# Altium schematic sheet Microphone-Arm_V1.0.SchDoc: Microphone-Arm
size A4; PageSetup: Record=PageOptions|CenterHorizontal=True|CenterVertical=True|PrintScale=0.97|XCorrection=1.00|YCorrection=1.00|PrintKind=0|BorderSize=5000000|LeftOffset=0|BottomOffset=0|Orientation=2|PaperLength=1000|PaperWidth=1000|Scale=100|PaperSource=7|PrintQuality=-3|MediaType=1|DitherType=10|PrintScaleMode=1|PaperKind=A4|PaperIndex=9; Organization: Ostschweizer Fachhochschule; Address2: Florian Baumgartner & Alain Keller; Address3: florian.baumgartner@ost.ch; DocumentNumber: 1; Revision: V1.0; SheetNumber: 1; SheetTotal: 1; Author: Florian Baumgartner & Alain Keller; Subtitle: Pivotable Microphone-Array Arm
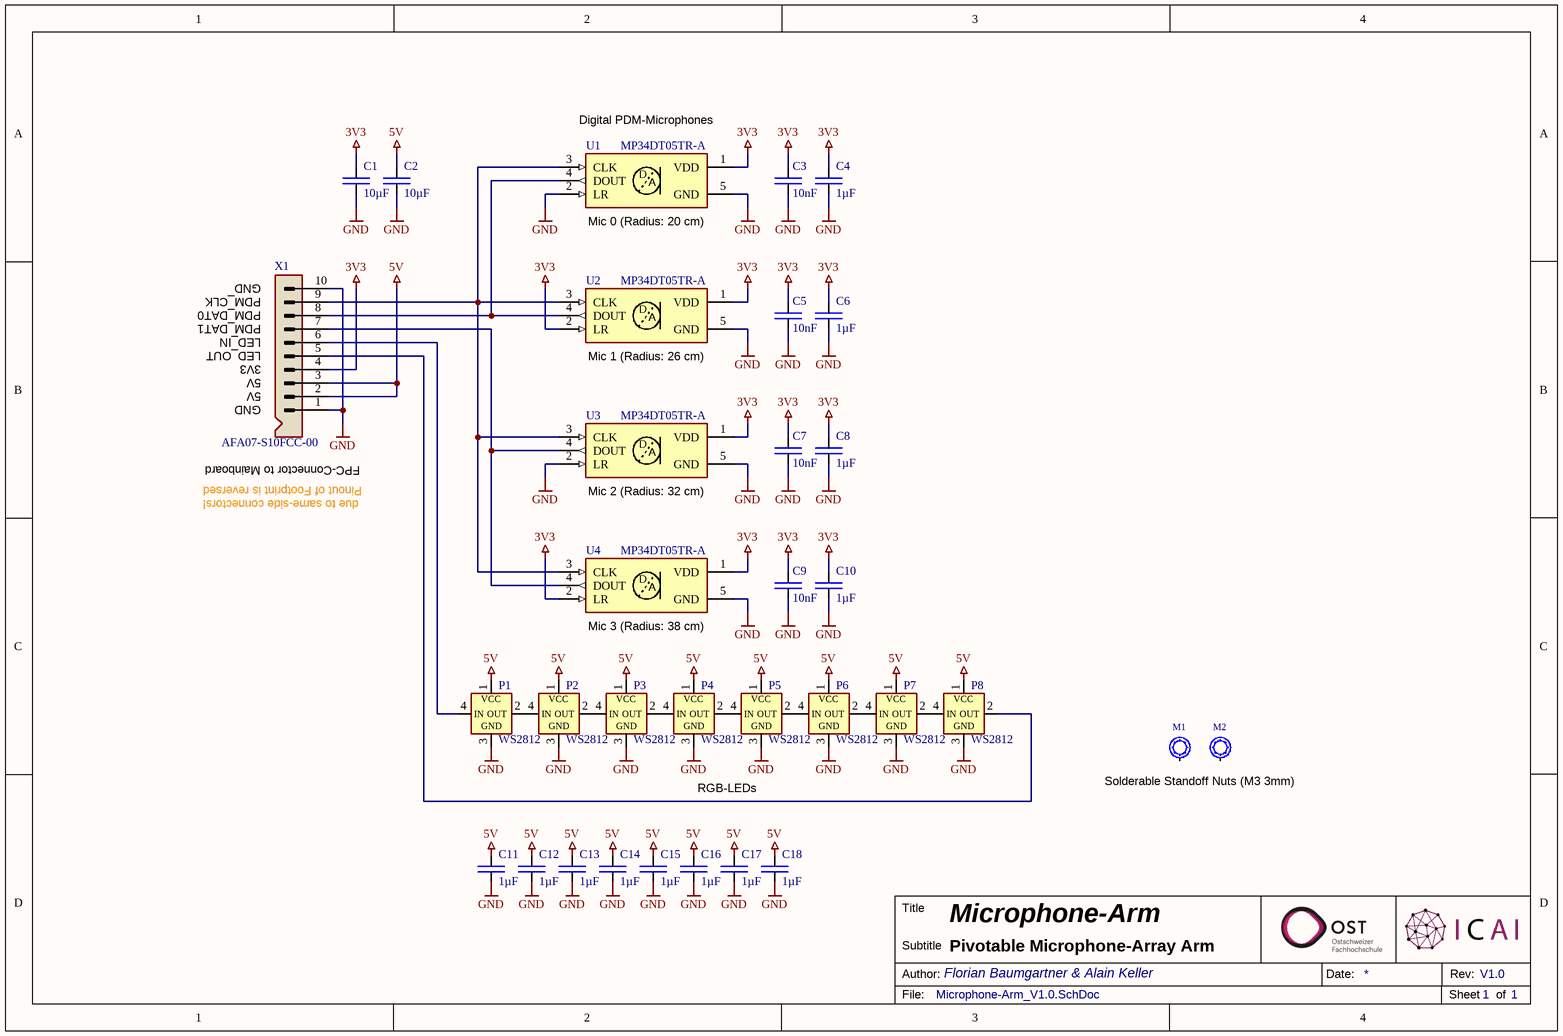
[diagram p0: Microphone-Arm_V1.0.SchDoc]

## Parts
C1  10µF  [SMD Keramikkondensator 1206]
C2  10µF  [SMD Keramikkondensator 1206]
C3  10nF  [SMD Keramikkondensator 0603]
C4  1µF  [SMD Keramikkondensator 0603]
C5  10nF  [SMD Keramikkondensator 0603]
C6  1µF  [SMD Keramikkondensator 0603]
C7  10nF  [SMD Keramikkondensator 0603]
C8  1µF  [SMD Keramikkondensator 0603]
C9  10nF  [SMD Keramikkondensator 0603]
C10  1µF  [SMD Keramikkondensator 0603]
C11  1µF  [SMD Keramikkondensator 0603]
C12  1µF  [SMD Keramikkondensator 0603]
C13  1µF  [SMD Keramikkondensator 0603]
C14  1µF  [SMD Keramikkondensator 0603]
C15  1µF  [SMD Keramikkondensator 0603]
C16  1µF  [SMD Keramikkondensator 0603]
C17  1µF  [SMD Keramikkondensator 0603]
C18  1µF  [SMD Keramikkondensator 0603]
M1  SMTSO-M3-3ET  [SMD Solder-Nut (M3 3mm)]  (value not drawn)
M2  SMTSO-M3-3ET  [SMD Solder-Nut (M3 3mm)]  (value not drawn)
P1  WS2812  [SMD LED WS2812B-0807]
P2  WS2812  [SMD LED WS2812B-0807]
P3  WS2812  [SMD LED WS2812B-0807]
P4  WS2812  [SMD LED WS2812B-0807]
P5  WS2812  [SMD LED WS2812B-0807]
P6  WS2812  [SMD LED WS2812B-0807]
P7  WS2812  [SMD LED WS2812B-0807]
P8  WS2812  [SMD LED WS2812B-0807]
U1  MP34DT05TR-A  [SMD Microphone (MP34DT05TR-A)]
U2  MP34DT05TR-A  [SMD Microphone (MP34DT05TR-A)]
U3  MP34DT05TR-A  [SMD Microphone (MP34DT05TR-A)]
U4  MP34DT05TR-A  [SMD Microphone (MP34DT05TR-A)]
X1  AFA07-S10FCC-00  [SMD Connector (AFA07-S10FCC-00) [Reversed]]

## Nets
3V3: C1.2 C3.2 C4.2 C5.2 C6.2 C7.2 C8.2 C9.2 C10.2 U1.1(VDD) U2.1(VDD) U2.2(LR) U3.1(VDD) U4.1(VDD) U4.2(LR) X1.4
5V: C2.2 C11.2 C12.2 C13.2 C14.2 C15.2 C16.2 C17.2 C18.2 P1.1(VCC) P2.1(VCC) P3.1(VCC) P4.1(VCC) P5.1(VCC) P6.1(VCC) P7.1(VCC) P8.1(VCC) X1.2 X1.3
GND: C1.1 C2.1 C3.1 C4.1 C5.1 C6.1 C7.1 C8.1 C9.1 C10.1 C11.1 C12.1 C13.1 C14.1 C15.1 C16.1 C17.1 C18.1 P1.3(GND) P2.3(GND) P3.3(GND) P4.3(GND) P5.3(GND) P6.3(GND) P7.3(GND) P8.3(GND) U1.2(LR) U1.5(GND) U2.5(GND) U3.2(LR) U3.5(GND) U4.5(GND) X1.1 X1.10
NetP1_2: P1.2(OUT) P2.4(IN)
NetP1_4: P1.4(IN) X1.6
NetP2_2: P2.2(OUT) P3.4(IN)
NetP3_2: P3.2(OUT) P4.4(IN)
NetP4_2: P4.2(OUT) P5.4(IN)
NetP5_2: P5.2(OUT) P6.4(IN)
NetP6_2: P6.2(OUT) P7.4(IN)
NetP7_2: P7.2(OUT) P8.4(IN)
NetP8_2: P8.2(OUT) X1.5
NetU1_3: U1.3(CLK) U2.3(CLK) U3.3(CLK) U4.3(CLK) X1.9
NetU1_4: U1.4(DOUT) U2.4(DOUT) X1.8
NetU3_4: U3.4(DOUT) U4.4(DOUT) X1.7

Not connected (* = marked no-connect by the designer): M1 1; M2 1

## Notes on the sheet
- (near U1) Digital PDM-Microphones
- (near U1) Mic 0 (Radius: 20 cm)
- (near X1) PDM_CLK
- (near X1) PDM_DAT0
- (near X1) GND
- (near X1) PDM_DAT1
- (near X1) LED_IN
- (near X1) LED_OUT
- (near X1) 5V
- (near X1) 3V3
- (near U2) Mic 1 (Radius: 26 cm)
- FPC-Connector to Mainboard
- Pinout of Footprint is reversed
- due to same-side connectors!
- (near U3) Mic 2 (Radius: 32 cm)
- (near U4) Mic 3 (Radius: 38 cm)
- RGB-LEDs
- Solderable Standoff Nuts (M3 3mm)
- Title
- Author:
- Subtitle
- Date:
- Rev:
- File:
- Sheet
- of
- (in symbol U-MP34DT05TR-A) D; A

## Library data of the parts
C1 C2 = E6 - 10uF: SMD Ceramic Capacitor E6; Component Value: 10µF 50V; Component Description: Multilayer Ceramic Capacitors MLCC; ComponentLink1Description: Datasheet; ComponentLink1URL: https://datasheet.lcsc.com/lcsc/1810191219_Samsung-Electro-Mechanics-CL10A106KP8NNNC_C19702.pdf; Digikey: 587-3258-1-ND; Farnell: 2113070; JLC-Parts: C13585; Mouser: 963-LMK107BBJ106MALT; Unit Price: 0.01
C3 C5 C7 C9 = C-CAPACITOR: CAP-MK; Component Description: Multilayer Ceramic Capacitors; Component Value: 10nF 50V; Digikey: 445-5662-1-ND; Farnell: 2346966; Mouser: 77-VJ0603V103ZXAPBC; JLC-Parts: C57112; Unit Price: 0.01
C4 C6 C8 C10-C18 = C-CAPACITOR: CAP-MK; Component Description: Multilayer Ceramic Capacitors; Component Value: 1µF 50V; Digikey: 1276-1860-1-ND; Farnell: 3013383; Mouser: 187-CL10A105KB8NNNC; JLC-Parts: C15849; Unit Price: 0.01
M1 M2 = M-Spacer_M3_3mm: Solderable Standoff Nut; Component Value: M3 3mm; Mouser: 153-SMTSO-M3-3ET; Component Description: Solderable Standoff Nut; Unit Price: 0.05; JLC-Parts: C2915308; ComponentLink1Description: Datasheet; ComponentLink1URL: https://datasheet.lcsc.com/lcsc/2112061830_Sinhoo-SMTSO3030CTJ_C2915308.pdf
P1-P8 = P-WS2812B-0807: Smart RGB-LED; aliExpress: 1005003999865721; Component Value: XL-0807RGBC-WS2812B; JLC-Parts: C3646929; ComponentLink1Description: Datasheet; ComponentLink1URL: https://datasheet.lcsc.com/lcsc/2108251530_OPSCO-Optoelectronics-SK6812D-EC3210R_C2890041.pdf; Component Description: Smart RGB-LED; Unit Price: 0.07
U1-U4 = U-MP34DT05TR-A: Digital PDM MEMS Microphone (Top Port); Digikey: 497-17809-1-ND; Farnell: 2851942; Mouser: 511-MP34DT05TR-A; ComponentLink1Description: Datasheet; ComponentLink1URL: https://datasheet.lcsc.com/lcsc/2106070037_STMicroelectronics-MP34DT05TR-A_C2688664.pdf; Component Description: Digital PDM MEMS Microphone (Top Port); Component Value: MP34DT05TR-A; JLC-Parts: C2688664; Unit Price: 1.50
X1 = X-FPC-Connector (10-Pin): FPC-Connector (10-Pin, Slide-Lock,  Bottom Contact); Digikey: 2073-FFC3B07-10-TCT-ND; Farnell: 3873345; Mouser: 640-FFC3B07-10-T; Component Description: FPC-Connector (10-Pin, Slide-Lock,  Bottom Contact); Component Value: AFA07-S10FCC-00; JLC-Parts: C52162; Unit Price: 0.09; ComponentLink1Description: Datasheet; ComponentLink1URL: https://datasheet.lcsc.com/lcsc/1811142212_JUSHUO-AFA07-S10FCC-00_C52162.pdf